# EAGLE design IRBumper_AB (EAGLE 9.5.0)
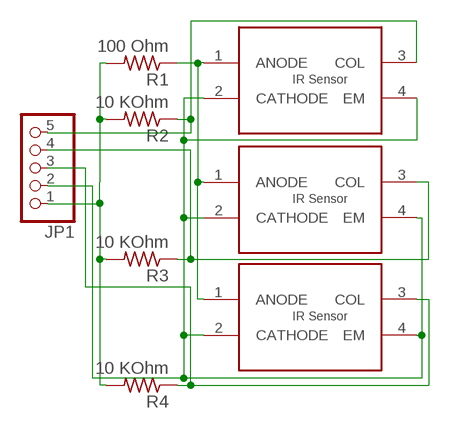
[diagram p0: schematic, sheet 1]

## Parts
JP1  PINHD-1X5  [1X05]
R1  100 Ohm  R-US_M0805  [M0805]
R2  10 KOhm  R-US_M0805  [M0805]
R3  10 KOhm  R-US_M0805  [M0805]
R4  10 KOhm  R-US_M0805  [M0805]
U$1  QRE1113GR  [4-SMD]
U$2  QRE1113GR  [4-SMD]
U$3  QRE1113GR  [4-SMD]

## Nets
GND: JP1.2 U$1.2(CATHODE) U$1.4(EM) U$2.2(CATHODE) U$2.4(EM) U$3.2(CATHODE) U$3.4(EM)
N$1: R1.1 U$1.1(ANODE) U$2.1(ANODE) U$3.1(ANODE)
N$2: JP1.5 R2.1 U$2.3(COL)
N$5: JP1.4 R3.1 U$1.3(COL)
N$6: JP1.3 R4.1 U$3.3(COL)
VDD_5: JP1.1 R1.2 R2.2 R3.2 R4.2

## Library data of the parts
JP1 = pinhead:PINHD-1X5: PIN HEADER
R1-R4 = rcl:R-US_: RESISTOR, American symbol; SPICEPREFIX: R
U$1-U$3 = MILESTONE4LIB_E:QRE1113GR

## Board
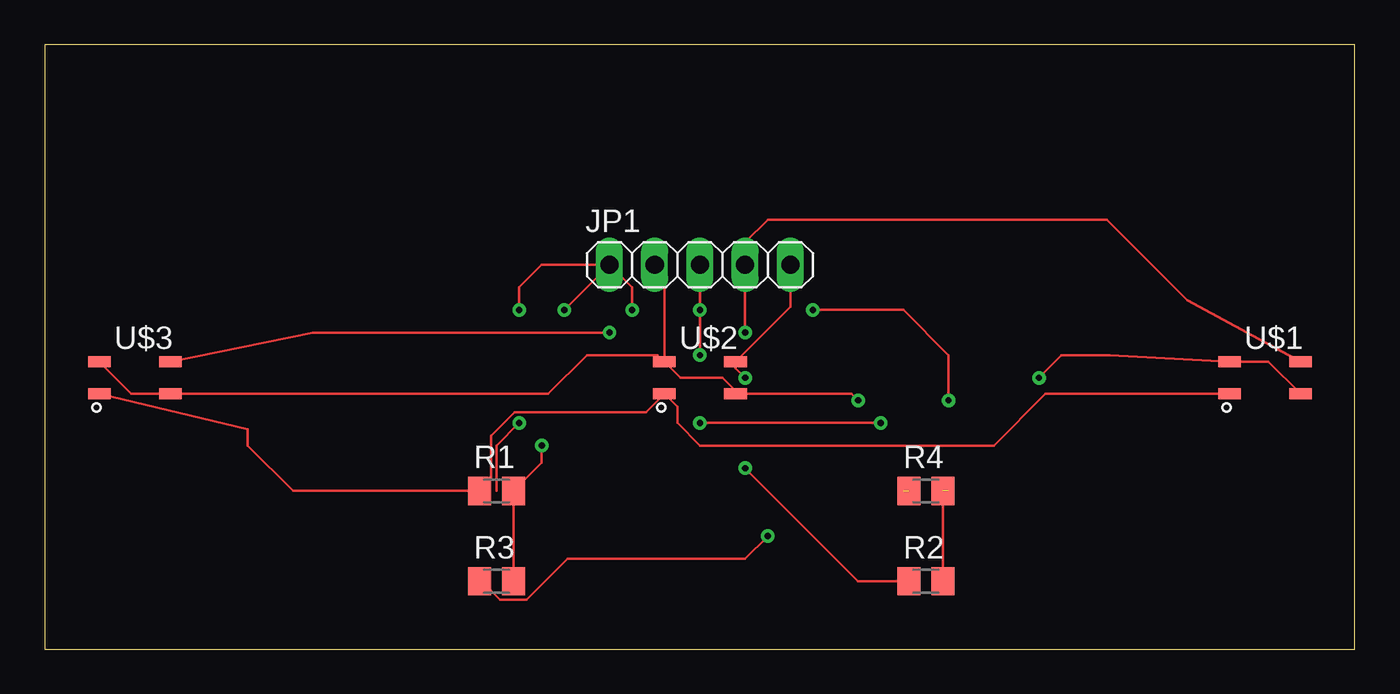
[diagram p1: board, top side]
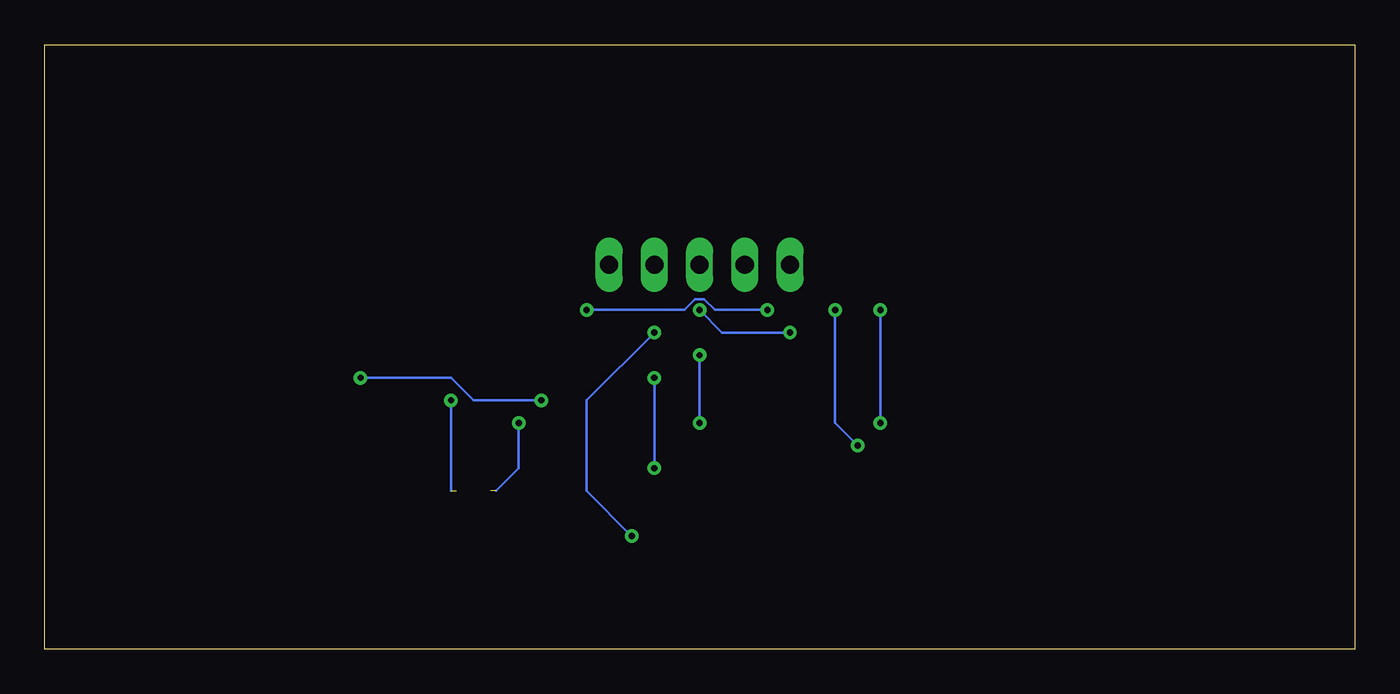
[diagram p2: board, bottom side, seen from below]

Size 73.64 x 33.96 mm. Coordinates in mm from the lower left corner, seen from the top.
Outline: 0,0 73.64,0 73.64,33.96 0,33.96 0,0
Copper layers (1*16): Top 0.035mm / dielectric 1.5mm / Bottom 0.035mm
Design rules "default": minimum track width 6mil, minimum drill 0.35mm, track to track 6mil, track to pad 6mil, pad to pad 6mil, via to via 6mil, smd to smd 6mil, copper to edge 40mil, drill to drill 6mil, minimum pad ring 10mil, minimum via ring 8mil, stop-mask expansion 4mil, vias tented up to drill 0mil, thermal gap 10mil

### Footprints (pad centres in the part's own frame; a part is rotated, then mirrored left to right if it is on the bottom)
1X05 = drill 1.016 long: 1 -5.08,0; 2 -2.54,0; 3 0,0; 4 2.54,0; 5 5.08,0
M0805 = smd 1.3 x 1.6: 1 -0.95,0; 2 0.95,0
4-SMD = smd 1.27 x 0.635: 1 -2,-0.9; 2 2,-0.9; 3 2,0.9; 4 -2,0.9

### Placement (x,y rotation side)
JP1  36.83,21.59 0 top
R1  25.4,8.89 0 top
R2  49.53,3.81 0 top
R3  25.4,3.81 0 top
R4  49.53,8.89 0 top
U$1  68.58,15.24 0 top
U$2  36.83,15.24 0 top
U$3  5.08,15.24 0 top

### Tracks (layer width: path | path; a pad name or v marks a point on that pad's centre or on a via)
GND  (via drill 0.35)
  Top 0.152: U$2.4 34.46,16.51 30.48,16.51 28.31,14.34 U$3.2 4.88,14.34 U$3.4 | v45.72,13.97 45.35,14.34 U$2.2 38.83,14.51 38.1,15.24 35.73,15.24 U$2.4 | JP1.2 34.83,21.05 U$2.4 | v55.88,15.24 57.15,16.51 59.86,16.51 U$1.4 68.78,16.14 U$1.2
  Bottom 0.152: v45.72,13.97 49.53,13.97 50.8,15.24 v55.88,15.24
N$1
  Top 0.152: U$3.1 11.43,12.34 11.43,11.43 13.97,8.89 R1.1 25.09,9.54 25.09,11.98 26.42,13.31 33.8,13.31 U$2.1 35.56,13.61 35.56,12.7 36.83,11.43 53.34,11.43 56.25,14.34 U$1.1
N$2  (via drill 0.35)
  Top 0.152: JP1.5 41.91,19.22 U$2.3 38.83,15.78 v39.37,15.24 | R2.1 45.72,3.81 v39.37,10.16
  Bottom 0.152: v39.37,10.16 v39.37,15.24
N$5  (via drill 0.35)
  Top 0.152: U$1.3 64.23,19.59 59.69,24.13 40.64,24.13 39.37,22.86 JP1.4 v39.37,17.78 | R3.1 24.58,3.81 25.6,2.78 27.09,2.78 29.39,5.08 39.37,5.08 v40.64,6.35
  Bottom 0.152: v40.64,6.35 43.18,8.89 43.18,13.97 v39.37,17.78
N$6  (via drill 0.35)  (1 unrouted)
  Top 0.152: U$3.3 15.07,17.78 v31.75,17.78 | JP1.3 v36.83,19.05 v36.83,16.51 | v36.83,12.7 v46.99,12.7
  Bottom 0.152: v36.83,19.05 35.56,17.78 v31.75,17.78 | v36.83,16.51 v36.83,12.7 | v46.99,12.7 46.99,10.16 48.26,8.89
VDD_5  (via drill 0.35)  (1 unrouted)
  Top 0.152: JP1.1 27.94,21.59 26.67,20.32 v26.67,19.05 | v26.67,12.7 25.4,11.43 25.4,8.89 | R3.2 R1.2 27.94,10.48 v27.94,11.43 | R2.2 R4.2 | JP1.1 v29.21,19.05 | JP1.1 33.02,20.32 v33.02,19.05 | v43.18,19.05 48.26,19.05 50.8,16.51 v50.8,13.97
  Bottom 0.152: v26.67,19.05 v26.67,12.7 | v29.21,19.05 29.21,12.7 v27.94,11.43 | v33.02,19.05 35.97,19.05 36.58,19.66 37.08,19.66 37.69,19.05 v43.18,19.05 | v50.8,13.97 50.8,8.89